# EAGLE design QuackDriveBSL (EAGLE 9.5.1)
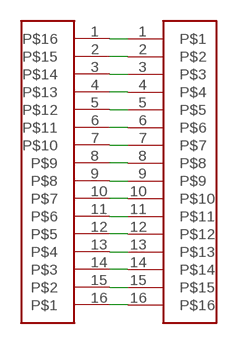
[diagram p0: schematic, sheet 1]

## Parts
U$1  WM8952DKR  [SOP80P420X355-16N]
U$2  WM8952DKR  [SOP80P420X355-16N]

## Nets
N$29: U$1.1 U$2.1
N$34: U$1.2 U$2.2
N$35: U$1.3 U$2.3
N$36: U$1.4 U$2.4
N$37: U$1.5 U$2.5
N$38: U$1.6 U$2.6
N$39: U$1.7 U$2.7
N$40: U$1.8 U$2.8
N$41: U$1.9 U$2.9
N$42: U$1.10 U$2.10
N$43: U$1.11 U$2.11
N$44: U$1.12 U$2.12
N$45: U$1.13 U$2.13
N$46: U$1.14 U$2.14
N$47: U$1.15 U$2.15
N$48: U$1.16 U$2.16

## Library data of the parts
U$1 = WM8952DKR F:WM8952DKR
U$2 = WM8952DKR F other half:WM8952DKR

## Net classes
0 Default: width 0.203 mm

## Board
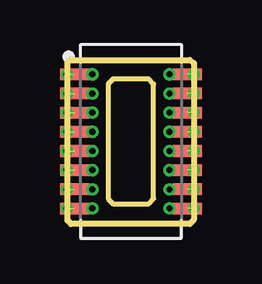
[diagram p1: board, top side]
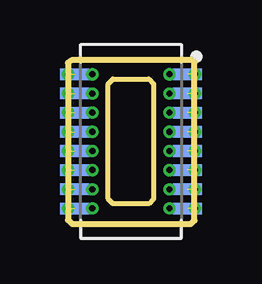
[diagram p2: board, bottom side, seen from below]

Size 5.27 x 6.85 mm. Coordinates in mm from the lower left corner, seen from the top.
Outline: 5.27,6.73 5.27,0.17 5.1,0 0.15,0 0,0.15 0,6.75 0.15,6.85 5.1,6.85 5.27,6.73
Outline: 1.9,0.85 3.4,0.85 3.6,1.05 3.6,5.85 3.4,6.05 1.9,6.05 1.7,5.85 1.7,1.05 1.9,0.85
Copper layers (1*16): Top 0.07mm / dielectric 0.8mm / Bottom 0.07mm
Design rules "default *": minimum track width 6mil, minimum drill 10mil, track to track 6mil, track to pad 6mil, pad to pad 6mil, via to via 6mil, smd to smd 0mil, copper to edge 6mil, drill to drill 6mil, minimum pad ring 5mil, minimum via ring 5mil, stop-mask expansion 4mil, vias tented up to drill 50mil, thermal gap 10mil

### Footprints (pad centres in the part's own frame; a part is rotated, then mirrored left to right if it is on the bottom)
SOP80P420X355-16N = smd 1.212 x 0.484: 1 -2.8,2.8; 2 -2.8,2; 3 -2.8,1.2; 4 -2.8,0.4; 5 -2.8,-0.4; 6 -2.8,-1.2; 7 -2.8,-2; 8 -2.8,-2.8; 9 1.9,-2.8; 10 1.9,-2; 11 1.9,-1.2; 12 1.9,-0.4; 13 1.9,0.4; 14 1.9,1.2; 15 1.9,2; 16 1.9,2.8
SOP80P420X355-16N' = smd 1.212 x 0.484: 1 1.91,2.8; 2 1.91,2; 3 1.91,1.2; 4 1.91,0.4; 5 1.91,-0.4; 6 1.91,-1.2; 7 1.91,-2; 8 1.91,-2.8; 9 -2.81,-2.8; 10 -2.81,-2; 11 -2.81,-1.2; 12 -2.81,-0.4; 13 -2.81,0.4; 14 -2.81,1.2; 15 -2.81,2; 16 -2.81,2.8

### Placement (x,y rotation side)
U$1  3.1,3.45 0 top
U$2  WM8952DKR  [SOP80P420X355-16N']  2.2,3.45 0 bottom

### Tracks (layer width: path | path; a pad name or v marks a point on that pad's centre or on a via)
N$29  (via drill 0.25)  (2 unrouted)
  Bottom 0.203: v1.04,6.25 U$2.1
  other vias: -0.02,6.25
N$34  (via drill 0.25)  (1 unrouted)
  Top 0.203: v1.04,5.45 U$1.2
  Bottom 0.203: U$2.2 v1.04,5.45
  other vias: -0.02,5.45
N$35  (via drill 0.25)  (2 unrouted)
  Top 0.203: U$1.3 v1.04,4.65
  other vias: -0.02,4.65
N$36  (via drill 0.25)  (1 unrouted)
  Top 0.203: v1.04,3.85 U$1.4
  Bottom 0.203: U$2.4 v1.04,3.85
  other vias: -0.02,3.85
N$37  (via drill 0.25)  (2 unrouted)
  Top 0.203: U$1.5 v1.04,3.05
  other vias: -0.02,3.05
N$38  (via drill 0.25)  (1 unrouted)
  Top 0.203: U$1.6 v1.04,2.25
  Bottom 0.203: v1.04,2.25 U$2.6
  other vias: -0.02,2.25
N$39  (via drill 0.25)  (2 unrouted)
  Top 0.203: v1.04,1.45 U$1.7
  other vias: -0.02,1.45
N$40  (via drill 0.25)  (1 unrouted)
  Top 0.203: U$1.8 v1.04,0.65
  Bottom 0.203: v1.04,0.65 U$2.8
  other vias: -0.02,0.65
N$41  (via drill 0.25)  (1 unrouted)
  Top 0.203: U$1.9 v4.26,0.65
  Bottom 0.203: v4.26,0.65 U$2.9
  other vias: 5.28,0.65
N$42  (via drill 0.25)  (2 unrouted)
  Top 0.203: v4.26,1.45 U$1.10
  other vias: 5.28,1.45
N$43  (via drill 0.25)  (1 unrouted)
  Top 0.203: U$1.11 v4.26,2.25
  Bottom 0.203: v4.26,2.25 U$2.11
  other vias: 5.28,2.25
N$44  (via drill 0.25)  (2 unrouted)
  Top 0.203: U$1.12 v4.26,3.05
  other vias: 5.28,3.05
N$45  (via drill 0.25)  (1 unrouted)
  Top 0.203: v4.26,3.85 U$1.13
  Bottom 0.203: U$2.13 v4.26,3.85
  other vias: 5.28,3.85
N$46  (via drill 0.25)  (2 unrouted)
  Bottom 0.203: U$2.14 v4.26,4.65
  other vias: 5.28,4.65
N$47  (via drill 0.25)  (1 unrouted)
  Top 0.203: U$1.15 v4.26,5.45
  Bottom 0.203: v4.26,5.45 U$2.15
  other vias: 5.28,5.45
N$48  (via drill 0.25)  (2 unrouted)
  Top 0.203: v4.26,6.25 U$1.16
  other vias: 5.28,6.25